# EAGLE schematic ArduinoMicroPrinter (EAGLE 6.5.0)
Arduino Thermo Printer
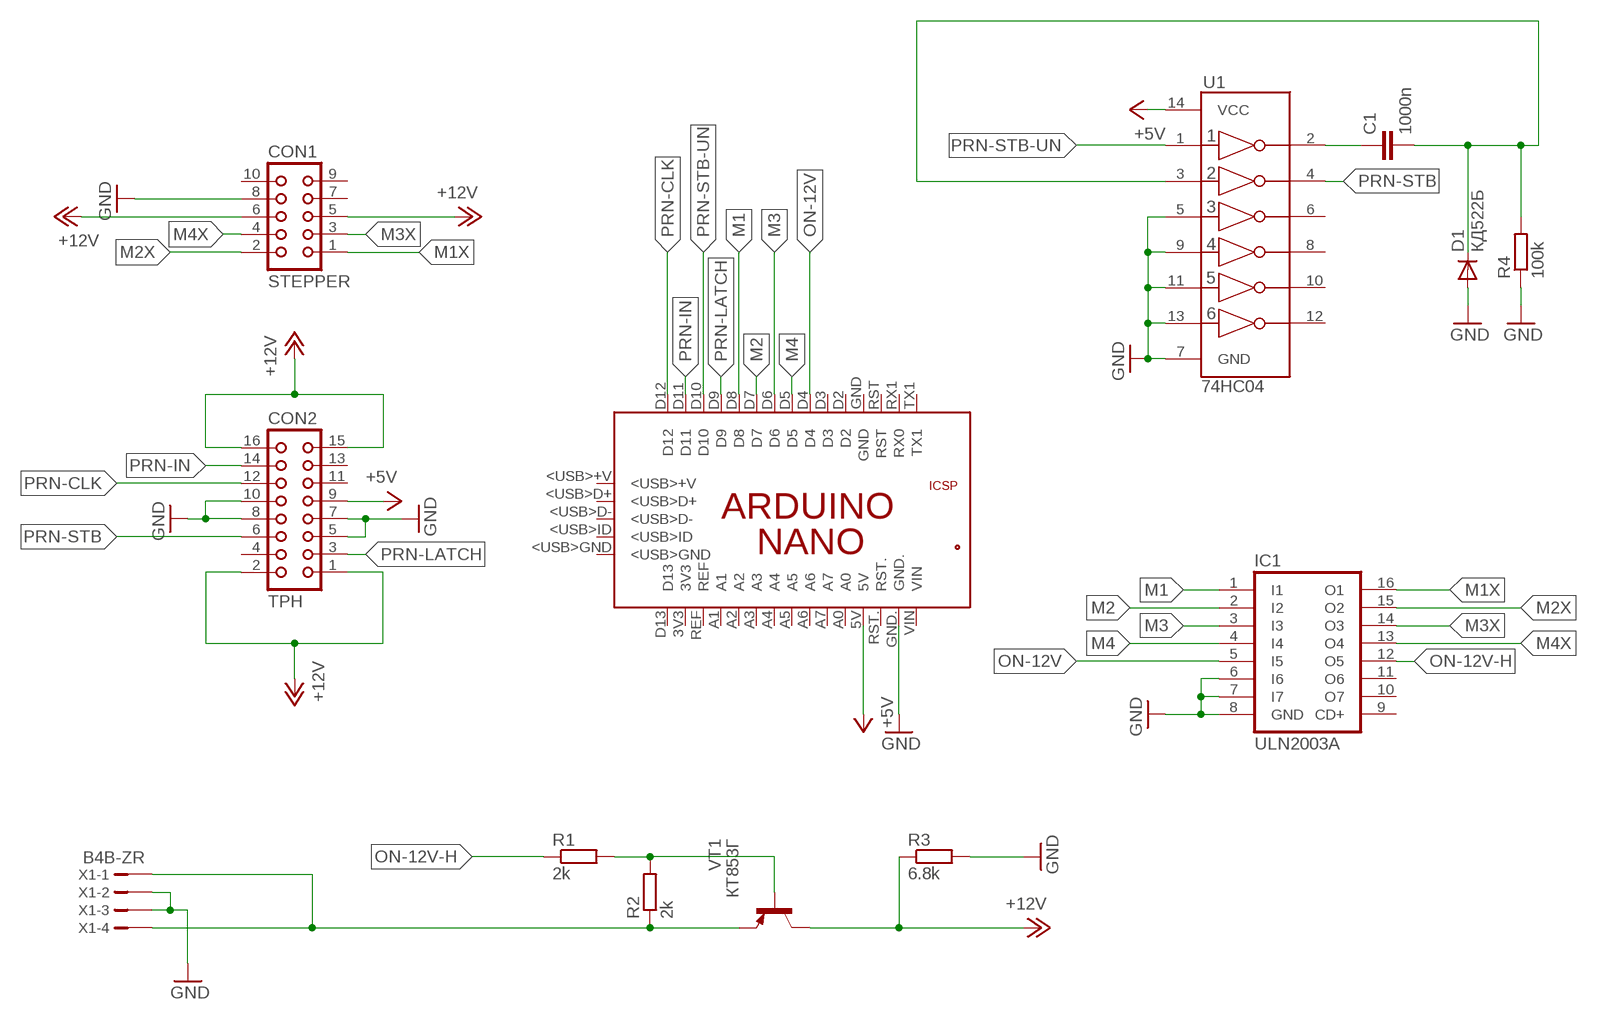
[diagram p0: schematic, sheet 1]

## Parts
C1  1000n  C-EU075-032X103  [C075-032X103]
CON1  STEPPER  CON10  [CON10]
CON2  TPH  CON16  [CON16]
D1  КД522Б  1N4148DO35-10  [DO35-10]
IC1  ULN2003A  ULN2003AN  [DIL16]
PCB1  ARDUINO_NANO  [ARDUINO_NANO]
R1  2k  R-EU_0207/12  [0207/12]
R2  2k  R-EU_0207/12  [0207/12]
R3  6.8k  R-EU_0207/12  [0207/12]
R4  100k  R-EU_0309/12  [0309/12]
U1  74HC04  74HC04_HEX_INVERTER  [DIL14]
VT1  КТ853Г  TIP30  [TO220]
X1  B4B-ZR  [B4B-ZR]

## Nets
+5V: CON2.9 PCB1.5V U1.14(VCC)
+12V: CON1.5 CON1.6 CON2.1 CON2.2 CON2.15 CON2.16 R3.1 VT1.2(C)
GND: CON1.8 CON2.5 CON2.7 CON2.8 CON2.10 D1.A IC1.6(I6) IC1.7(I7) IC1.8(GND) PCB1.GND. R3.2 R4.1 U1.5(3A) U1.7(GND) U1.9(4A) U1.11(5A) U1.13(6A) X1.2 X1.3
M1: IC1.1(I1) PCB1.D8
M1X: CON1.1 IC1.16(O1)
M2: IC1.2(I2) PCB1.D7
M2X: CON1.2 IC1.15(O2)
M3: IC1.3(I3) PCB1.D6
M3X: CON1.3 IC1.14(O3)
M4: IC1.4(I4) PCB1.D5
M4X: CON1.4 IC1.13(O4)
N$1: C1.1 U1.2(1Y)
N$2: C1.2 D1.C R4.2 U1.3(2A)
N$3: R1.2 R2.2 VT1.1(B)
N$5: R2.1 VT1.3(E) X1.1 X1.4
ON-12V: IC1.5(I5) PCB1.D4
ON-12V-H: IC1.12(O5) R1.1
PRN-CLK: CON2.12 PCB1.D12
PRN-IN: CON2.14 PCB1.D11
PRN-LATCH: CON2.3 PCB1.D9
PRN-STB: CON2.6 U1.4(2Y)
PRN-STB-UN: PCB1.D10 U1.1(1A)
Unconnected: CON1.7 CON1.9 CON1.10 CON2.4 CON2.11 CON2.13 IC1.9(CD+) IC1.10(O7) IC1.11(O6) PCB1.3V3 PCB1.5V. PCB1.<USB>+V PCB1.<USB>D+ PCB1.<USB>D- PCB1.<USB>GND PCB1.<USB>ID PCB1.A0 PCB1.A1 PCB1.A2 PCB1.A3 PCB1.A4 PCB1.A5 PCB1.A6 PCB1.A7 PCB1.D2 PCB1.D3 PCB1.D13 PCB1.GND PCB1.GND_ PCB1.MISO PCB1.MOSI PCB1.REF PCB1.RESET.. PCB1.RST PCB1.RST. PCB1.RX1(RX0) PCB1.SCK PCB1.TX1 PCB1.VIN U1.6(3Y) U1.8(4Y) U1.10(5Y) U1.12(6Y)

## Library data of the parts
C1 = resistor:C-EU: CAPACITOR, European symbol
CON1 = con-harting:CON10: CONNECTOR; MF: TE CONNECTIVITY / AMP; MPN: 0-281273-1; OC_FARNELL: 3816278; OC_NEWARK: unknown
CON2 = con-harting:CON16: CONNECTOR; MF: TE CONNECTIVITY / AMP; MPN: 1-1634688-0; OC_FARNELL: 8395918; OC_NEWARK: unknown
D1 = diode:1N4148: DIODE high speed (Philips)
IC1 = uln-udn:ULN2003A: DRIVER ARRAY
PCB1 = E14_Arduino:ARDUINO_NANO: Device for representing an Arduino Nano board with a footprint in an EAGLE design. Created by Dave Young for Element14. More EAGLE documentation at: http://www.element14.com/community/community/knode/cadsoft_eagle; MF: ARDUINO; MPN: A000005; OC_FARNELL: 1848691
R1-R4 = resistor:R-EU_: RESISTOR, European symbol
U1 = 74hc04:74HC04_HEX_INVERTER: 74HC04 Hex Inverter
VT1 = transistor-pnp:TIP30: PNP Transistor
X1 = con-jst:?4B-ZR: ZH CONNECTOR 1.5 mm, 4 pin 1 row Source: http://www.jst.com .. eZH.pdf; MF: FARNELL; MPN: B4B-ZR(LF)(SN); OC_FARNELL: 1830916; OC_NEWARK: 37K9960